# Altium schematic sheet ad5941.SchDoc
size A4; SheetNumber: 1; SheetTotal: 3
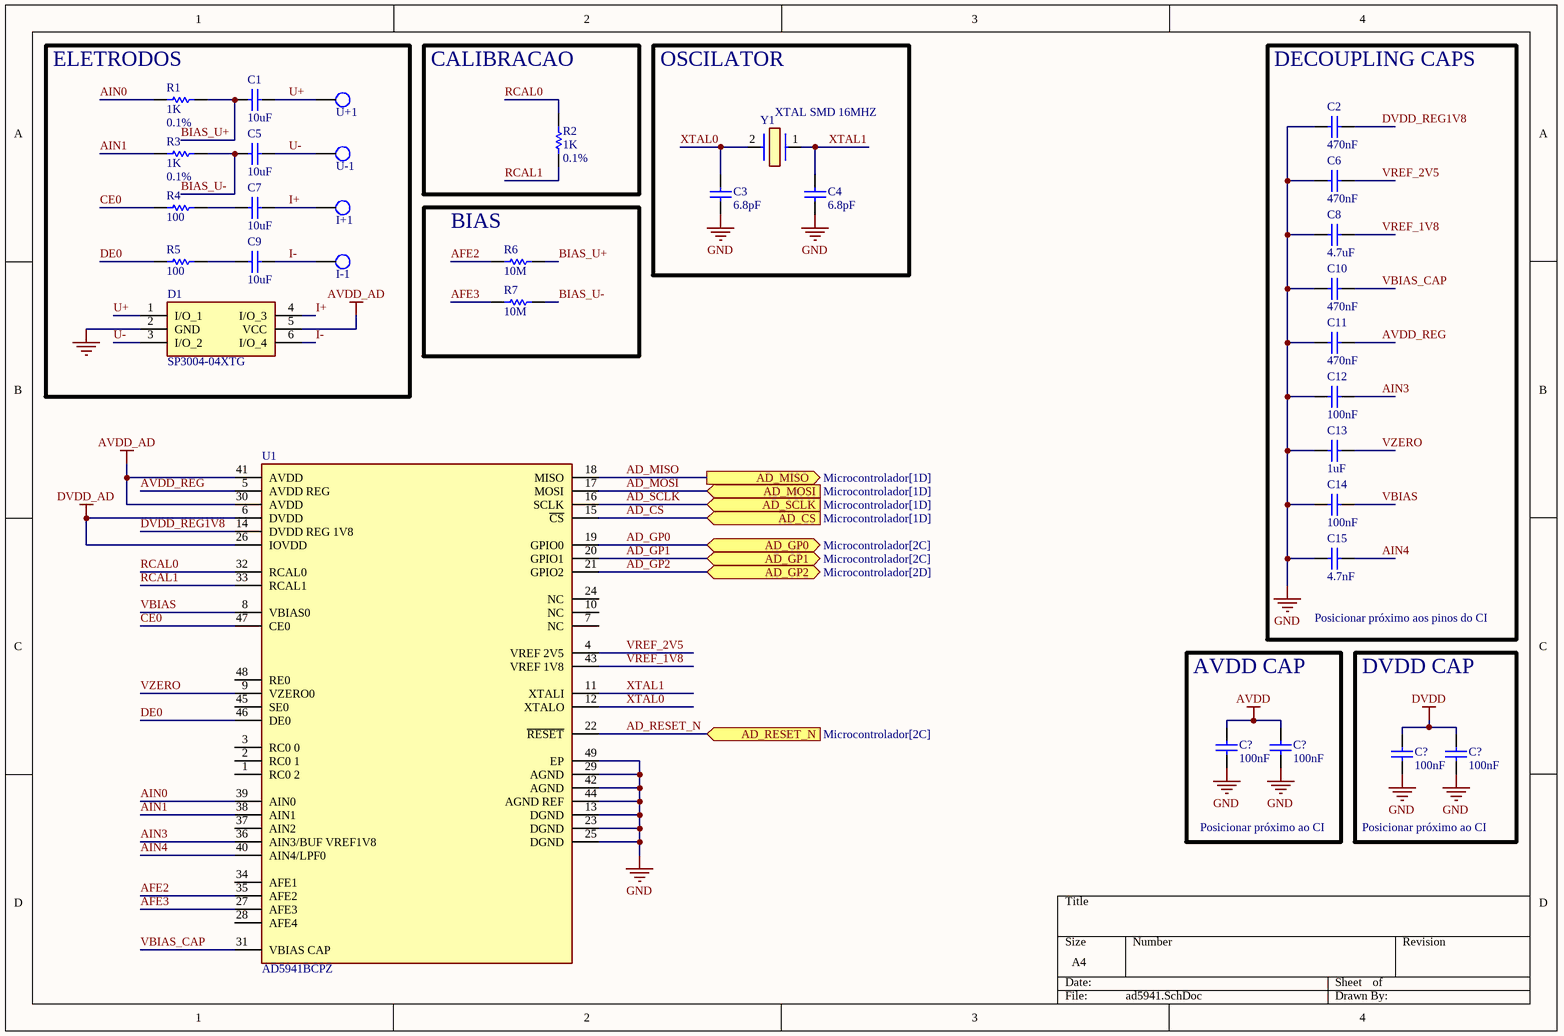
[diagram p0: ad5941.SchDoc]

## Parts
(Parts that share a designator on the sheet are numbered #1, #2 ... from top to bottom, then left to right.)
C1  value 10uF  [CAP0805OK]  (hidden comment: CAP SMD CER 10UF 50V 1206)
C2  value 470nF  [CAP0805OK]  (hidden comment: CAP SMD CER 470NF 100V 0805)
C3  value 6.8pF  [CAP0805OK]  (hidden comment: CAP SMD CER 6.8PF 25V 0805)
C4  value 6.8pF  [CAP0805OK]  (hidden comment: CAP SMD CER 6.8PF 25V 0805)
C5  value 10uF  [CAP0805OK]  (hidden comment: CAP SMD CER 10UF 50V 1206)
C6  value 470nF  [CAP0805OK]  (hidden comment: CAP SMD CER 470NF 100V 0805)
C7  value 10uF  [CAP0805OK]  (hidden comment: CAP SMD CER 10UF 50V 1206)
C8  value 4.7uF  [CAP0805OK]  (hidden comment: CAP SMD CER 4.7UF 50V 0805)
C9  value 10uF  [CAP0805OK]  (hidden comment: CAP SMD CER 10UF 50V 1206)
C10  value 470nF  [CAP0805OK]  (hidden comment: CAP SMD CER 470NF 100V 0805)
C11  value 470nF  [CAP0805OK]  (hidden comment: CAP SMD CER 470NF 100V 0805)
C12  value 100nF  [CAP0805OK]  (hidden comment: CAP SMD CER 100NF 25V 0805)
C13  value 1uF  [CAP0805OK]  (hidden comment: CAP SMD CER 1UF 10V 0805)
C14  value 100nF  [CAP0805OK]  (hidden comment: CAP SMD CER 100NF 25V 0805)
C15  value 4.7nF  [CAP0805OK]  (hidden comment: CAP SMD CER 4.7NF 25V 0805)
C?#1  value 100nF  [CAP0805OK]  (hidden comment: CAP SMD CER 100NF 25V 0805)
C?#2  value 100nF  [CAP0805OK]  (hidden comment: CAP SMD CER 100NF 25V 0805)
C?#3  value 100nF  [CAP0805OK]  (hidden comment: CAP SMD CER 100NF 25V 0805)
C?#4  value 100nF  [CAP0805OK]  (hidden comment: CAP SMD CER 100NF 25V 0805)
D1  SP3004-04XTG  [SOTFL50P160X60-6N]
I+1  I+  [TEST POINT]  (value not drawn)
I-1  I-  [TEST POINT]  (value not drawn)
R1  value 1K  Tolerance: 0.1%  [res0805ok]  (hidden comment: RES SMD 1K6 0.1% 0805)
R2  value 1K  Tolerance: 0.1%  [res0805ok]  (hidden comment: RES SMD 1K 1% 0805)
R3  value 1K  Tolerance: 0.1%  [res0805ok]  (hidden comment: RES SMD 1K6 0.1% 0805)
R4  value 100  [res0805ok]  (hidden comment: RES SMD 100R 1% 0805)
R5  value 100  [res0805ok]  (hidden comment: RES SMD 100R 1% 0805)
R6  value 10M  [res0805ok]  (hidden comment: RES SMD 10M 5% 0805)
R7  value 10M  [res0805ok]  (hidden comment: RES SMD 10M 5% 0805)
U1  AD5941BCPZ  [FP-CP-48-4-IPC_A]
U+1  U+  [TEST POINT]  (value not drawn)
U-1  U-  [TEST POINT]  (value not drawn)
Y1  XTAL SMD 16MHZ  [XTAL SMD 16MHZ]

## Blocks framed on the sheet
ELETRODOS: C1 C5 C7 C9 D1 I+1 I-1 R1 R3-R5 U+1 U-1
CALIBRACAO: R2
OSCILATOR: C3 C4 Y1
DECOUPLING CAPS: C2 C6 C8 C10-C15
BIAS: R6 R7
AVDD CAP: C?#1 C?#2
DVDD CAP: C?#3 C?#4

## Ports
AD_CS (in, see Microcontrolador[1D]), AD_GP0 (bidir, see Microcontrolador[2C]), AD_GP1 (bidir, see Microcontrolador[2C]), AD_GP2 (bidir, see Microcontrolador[2D]), AD_MISO (out, see Microcontrolador[1D]), AD_MOSI (in, see Microcontrolador[1D]), AD_RESET_N (in, see Microcontrolador[2C]), AD_SCLK (in, see Microcontrolador[1D])

## Nets
AVDD: C?#1.1 C?#2.1
AVDD_AD: D1.5(VCC) U1.30(AVDD) U1.41(AVDD)
DVDD: C?#3.1 C?#4.1
DVDD_AD: U1.6(DVDD) U1.26(IOVDD)
GND: C2.1 C3.2 C4.2 C6.1 C8.1 C10.1 C11.1 C12.2 C13.1 C14.2 C15.2 C?#1.2 C?#2.2 C?#3.2 C?#4.2 D1.2(GND) U1.13(DGND) U1.23(DGND) U1.25(DGND) U1.29(AGND) U1.42(AGND) U1.44(AGND_REF) U1.49(EP)
AD_CS: U1.15(~{CS}) ; port AD_CS
AD_GP0: U1.19(GPIO0) ; port AD_GP0
AD_GP1: U1.20(GPIO1) ; port AD_GP1
AD_GP2: U1.21(GPIO2) ; port AD_GP2
AD_MISO: U1.18(MISO) ; port AD_MISO
AD_MOSI: U1.17(MOSI) ; port AD_MOSI
AD_RESET_N: U1.22(~{RESET}) ; port AD_RESET_N
AD_SCLK: U1.16(SCLK) ; port AD_SCLK
AFE2: R6.1 U1.35(AFE2)
AFE3: R7.1 U1.27(AFE3)
AIN0: R1.1 U1.39(AIN0)
AIN1: R3.1 U1.38(AIN1)
AIN3: C12.1 U1.36(AIN3/BUF_VREF1V8)
AIN4: C15.1 U1.40(AIN4/LPF0)
AVDD_REG: C11.2 U1.5(AVDD_REG)
BIAS_U+: C1.1 R1.2 R6.2
BIAS_U-: C5.1 R3.2 R7.2
CE0: R4.1 U1.47(CE0)
DE0: R5.1 U1.46(DE0)
DVDD_REG1V8: C2.2 U1.14(DVDD_REG_1V8)
I+: C7.2 D1.4(I/O_3) I+1.0
I-: C9.2 D1.6(I/O_4) I-1.0
RCAL0: R2.2 U1.32(RCAL0)
RCAL1: R2.1 U1.33(RCAL1)
U+: C1.2 D1.1(I/O_1) U+1.0
U-: C5.2 D1.3(I/O_2) U-1.0
VBIAS: C14.1 U1.8(VBIAS0)
VBIAS_CAP: C10.2 U1.31(VBIAS_CAP)
VREF_1V8: C8.2 U1.43(VREF_1V8)
VREF_2V5: C6.2 U1.4(VREF_2V5)
VZERO: C13.2 U1.9(VZERO0)
XTAL0: C3.1 U1.12(XTALO) Y1.2
XTAL1: C4.1 U1.11(XTALI) Y1.1
NetC7_1: C7.1 R4.2
NetC9_1: C9.1 R5.2

Not connected (* = marked no-connect by the designer): U1 1(RC0_2) 2(RC0_1) 3(RC0_0) 7(NC) 10(NC) 24(NC) 28(AFE4) 34(AFE1) 37(AIN2) 45(SE0) 48(RE0)

## Notes on the sheet
- Posicionar próximo aos pinos do CI
- Posicionar próximo ao CI

## Library data of the parts
C1 C5 C7 C9 = CAP SMD CER 10UF 10V 0805: Multilayer Ceramic Capacitors MLCC - SMD/SMT 10 uF 10 VDC 10% 0805 X7R; COD. CRISTOFOLI: EMP.00322; Tolerance: 20%; List: CAP CER 10UF 50V X5R 1206/UMK316BBJ106ML-T/Generic; Voltage: 50V; Type: CERAMIC
C2 C6 C10 C11 = CAP SMD CER 470NF 100V 0805: COD. CRISTOFOLI: EMP.00245; Tolerance: 10%; List: CAP CER 0.47UF 100V 10% X7R 0805/GRM21BR72A474KA73L/Murata Electronics North America; Type: CERAMIC; Voltage: 100V
C3 C4 C12 C14 C15 C?#1-C?#4 = CAP SMD CER 100NF 25V 0805: COD. CRISTOFOLI: EMP.00094; Tolerance: 10%; List: CAP CER 0.1UF 25V 10% X7R 0805/CGJ4J2X7R1E104K125AA/TDK; Type: CERAMIC; Voltage: 25V
C8 = CAP SMD CER 4.7UF 50V 0805: COD. CRISTOFOLI: EMP.00333; Tolerance: 10%; List: CAP CER 4.7UF 50V X5R 0805/CL21A475KBQNNNE/Samsung; Type: CERAMIC; Voltage: 50V
C13 = CAP SMD CER 1UF 10V 0805: COD. CRISTOFOLI: EMP.00209; Tolerance: 20%; List: CAP- SMD/SMT X7R 0805 10V 1uF 20%/LMK212BJ105MG-T/Taiyo Yuden; Type: CERAMIC; Voltage: 10V
D1 = SP3004-04XTG: TVS Diode (Uni-directional); Manufacturer_Name: LITTELFUSE; Datasheet Link: https://m.littelfuse.com/~/media/electronics/datasheets/tvs_diode_arrays/littelfuse_tvs_diode_array_sp3004_datasheet.pdf.pdf; Height: 0.6mm; Manufacturer_Part_Number: SP3004-04XTG; Mouser Part Number: 576-SP3004-04XTG; Mouser Price/Stock: https://www.mouser.co.uk/ProductDetail/Littelfuse/SP3004-04XTG?qs=trbuaetfxXQ7JjseAkJ3Ww%3D%3D; Arrow Part Number: SP3004-04XTG; Arrow Price/Stock: https://www.arrow.com/en/products/sp3004-04xtg/littelfuse?region=nac
I+1 I-1 U+1 U-1 = TEST POINT
R1 R3 = RES SMD 1K6 0.1% 0805: COD. CRISTOFOLI: EMP.00204; List: RES 1.6K OHM 1/8W .1% 0805 SMD/ERA-6AEB162V/Panasonic Electronic Components/Generic
R2 = RES SMD 1K 1% 0805: COD. CRISTOFOLI: EMP.50098; List: RES SMD 1K 1% 0805
R4 R5 = RES SMD 10R 1% 0805: COD. CRISTOFOLI: EMP.50001; List: RES SMD 10R 1% 0805; Tolerance: 1%
R6 R7 = RES SMD 10R 1% 0805: COD. CRISTOFOLI: EMP.50001; Tolerance: 1%; List: RES SMD 10R 1% 0805
U1 = CMP-09085-000021-2: BIO-IMPEDANCE & ELECTROCHEMICAL; RoHS Compliant: Yes
Y1 = XTAL SMD 16MHZ: Crystal or Oscillator; Manufacturer_Name: Vishay; Manufacturer_Part_Number: XT9M20ANA16M; Datasheet Link: https://componentsearchengine.com/Datasheets/5/XT9M20ANA16M.pdf; Height: 4.5mm; Mouser Part Number: 73-XT49M1600-20; Mouser Price/Stock: https://www.mouser.co.uk/ProductDetail/Vishay-Dale/XT9M20ANA16M?qs=NVJATC80C4%252B3oEpMmPFr7g%3D%3D; Arrow Part Number: XT9M20ANA16M; Arrow Price/Stock: https://www.arrow.com/en/products/xt9m20ana16m/vishay?region=nac